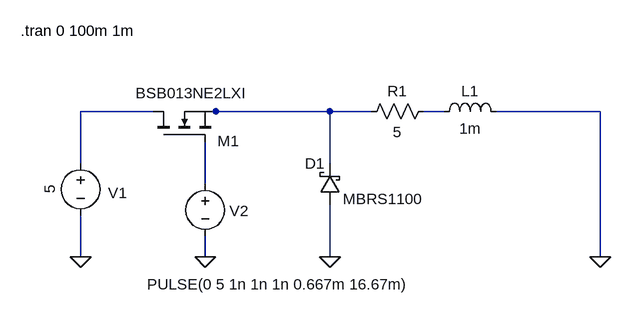
[diagram p0: schematic Draft2.asc]
Draft2.asc, the LTspice schematic file:
Version 4
SHEET 1 1176 704
WIRE -112 64 -224 64
WIRE -16 64 -48 64
WIRE 160 64 -16 64
WIRE 224 64 160 64
WIRE 336 64 304 64
WIRE 576 64 416 64
WIRE -224 144 -224 64
WIRE 160 144 160 64
WIRE -32 176 -32 112
WIRE -224 288 -224 224
WIRE -32 288 -32 256
WIRE 160 288 160 208
WIRE 576 288 576 64
FLAG -224 288 0
FLAG -32 288 0
FLAG 576 288 0
FLAG 160 288 0
SYMBOL res 320 48 R90
WINDOW 0 0 56 VBottom 2
WINDOW 3 32 56 VTop 2
SYMATTR InstName R1
SYMATTR Value 5
SYMBOL ind 320 80 R270
WINDOW 0 32 56 VTop 2
WINDOW 3 5 56 VBottom 2
SYMATTR InstName L1
SYMATTR Value 1m
SYMBOL voltage -224 128 R0
WINDOW 0 57 46 Top 2
WINDOW 3 -32 56 VBottom 2
WINDOW 123 0 0 Left 0
WINDOW 39 0 0 Left 0
SYMATTR InstName V1
SYMATTR Value 5
SYMBOL voltage -32 160 R0
WINDOW 0 52 42 Top 2
WINDOW 3 113 186 Bottom 2
WINDOW 123 0 0 Left 0
WINDOW 39 0 0 Left 0
SYMATTR InstName V2
SYMATTR Value PULSE(0 5 1n 1n 1n 0.667m 16.67m)
SYMBOL nmos -112 112 R270
WINDOW 0 2 99 VRight 2
WINDOW 3 76 -27 VRight 2
SYMATTR InstName M1
SYMATTR Value BSB013NE2LXI
SYMBOL schottky 176 208 R180
WINDOW 0 24 64 Left 2
WINDOW 3 -127 9 Left 2
SYMATTR InstName D1
SYMATTR Value MBRS1100
SYMATTR Description Diode
SYMATTR Type diode
TEXT -316 -60 Left 2 !.tran 0 100m 1m

The netlist it stands for:
* Draft2.asc
R1 N003 N002 5
L1 N003 0 1m
V1 N001 0 5
V2 N004 0 PULSE(0 5 1n 1n 1n 0.667m 16.67m)
M1 N001 N004 N002 N002 BSB013NE2LXI
D1 0 N002 MBRS1100
.model D D
.lib standard.dio
.model NMOS NMOS
.model PMOS PMOS
.lib standard.mos
.tran 0 100m 1m
.backanno
.end